# Altium project Lab10.PrjPcb
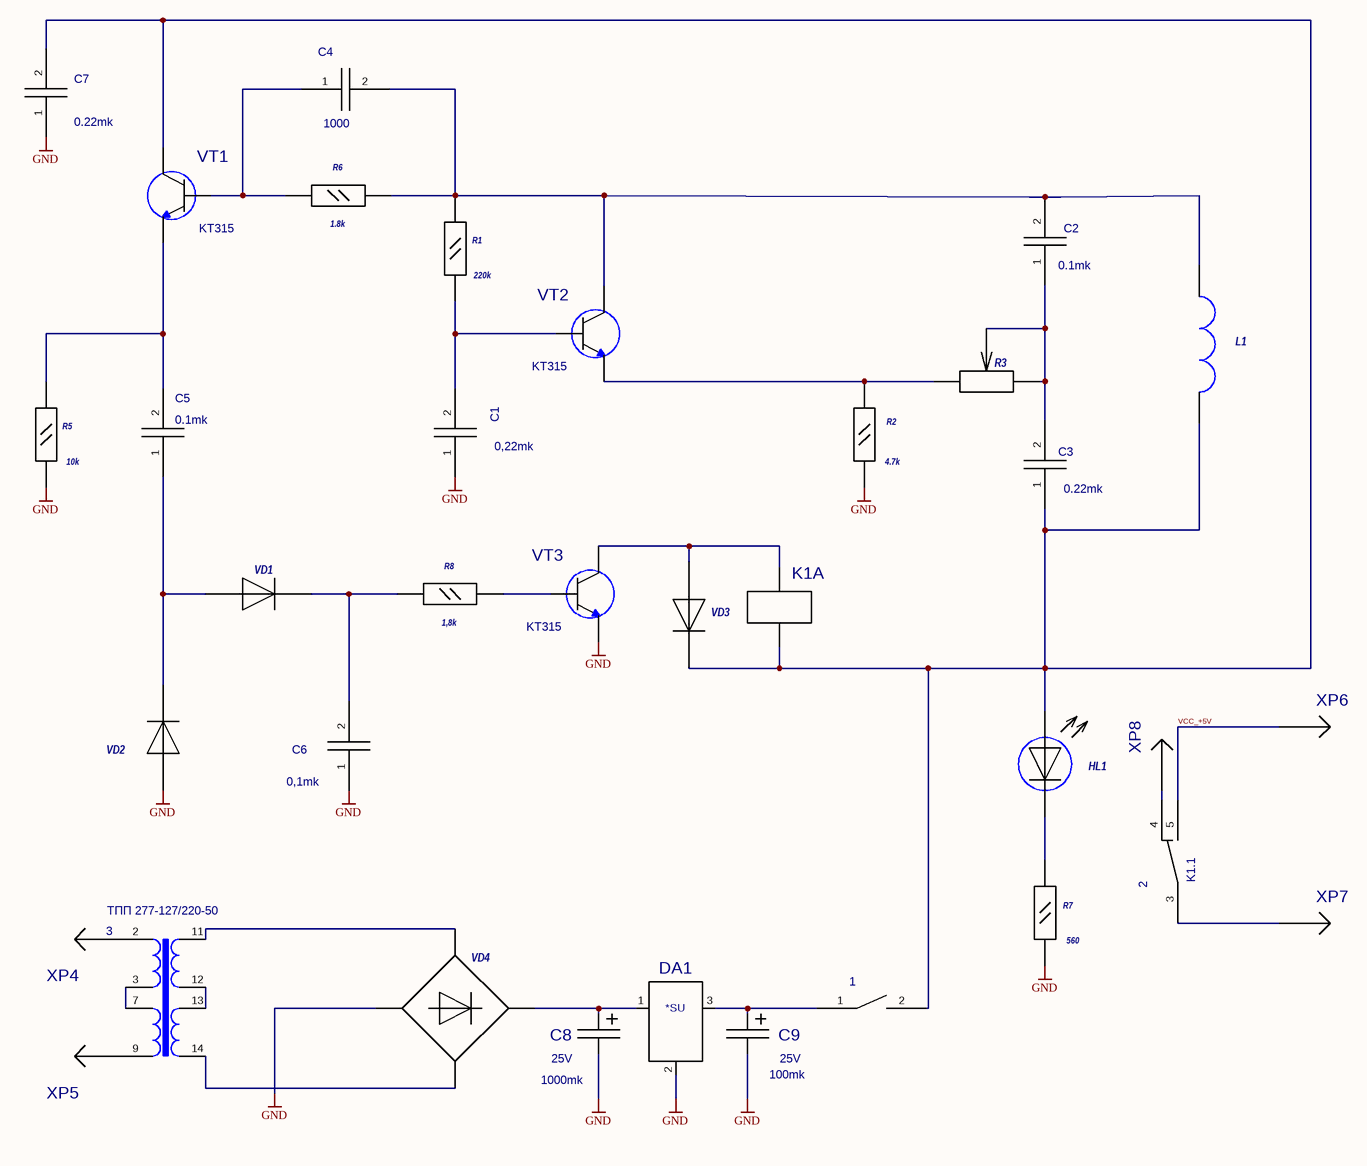
[diagram p0: Sheet1.SCHDOC]
1 sheet, 35 parts. Net scope: global (net labels, ports and power ports of the same name join across sheets).

## Sheet Sheet1.SCHDOC
size 420 x 297 mm; SheetNumber: 1; SheetTotal: 1; DocumentName: Sheet1.SCHDOC

### Parts
1  T1  [T1]  (value not drawn)
2  K1.1  [K1.1]
3  ТПП 277-127/220-50  [ТПП 277-127/220-50]
C1  value 0,22mk  [KM6A - M47]  (hidden comment: 25)
C2  value 0.1mk  [KM6A - M47]  (hidden comment: 25)
C3  value 0.22mk  [KM6A - M47]  (hidden comment: 25)
C4  value 1000  [KM6A - M47]  (hidden comment: 25)
C5  value 0.1mk  [KM6A - M47]  (hidden comment: 25)
C6  value 0,1mk  [KM6A - M47]  (hidden comment: 25)
C7  value 0.22mk  [KM6A - M47]  (hidden comment: 25)
C8  value 25V  [K534A-1]  (hidden comment: K534A-1)
C9  value 25V  [K534A-1]  (hidden comment: K534A-1)
DA1  KR142EN  [KR142EN]  (value not drawn)
HL1  АЛ307  [АЛ307]  (value not drawn)
K1  РЭС-64  [RES64]  (value not drawn)  (part A of 2)
L1  L (3,5)  [L (3,5)]  (value not drawn)
R1  value 220k  [МЛТ(0.125)]  (hidden comment: МЛТ(0.125))
R2  value 4.7k  [МЛТ(0.125)]  (hidden comment: МЛТ(0.125))
R3  СП3-38В  [СП3-38В]  (value not drawn)
R5  value 10k  [МЛТ(0.125)]  (hidden comment: МЛТ(0.125))
R6  value 1.8k  [МЛТ(0.125)]  (hidden comment: МЛТ(0.125))
R7  value 560  [МЛТ(0.125)]  (hidden comment: МЛТ(0.125))
R8  value 1,8k  [МЛТ(0.125)]  (hidden comment: МЛТ(0.125))
VD1  КД522Б  [КД522]  (value not drawn)
VD2  КД522Б  [КД522]  (value not drawn)
VD3  КД522Б  [КД522]  (value not drawn)
VD4  КЦ407  [КЦ407]  (value not drawn)
VT1  KT315  [KT-13]
VT2  KT315  [KT-13]
VT3  KT315  [KT-13]
XP4  XP1  [PAD]  (value not drawn)
XP5  XP1  [PAD]  (value not drawn)
XP6  XP1  [PAD]  (value not drawn)
XP7  XP1  [PAD]  (value not drawn)
XP8  XP1  [PAD]  (value not drawn)

### Nets
GND: C1.1 C6.1 C7.1 C8.2(I/OB) C9.2(I/OB) DA1.2(GND0) R2.1 R5.1 R7.1 VD2.1 VD4.1 VT3.1(E)
VCC_+5V: 2.5 XP6.1(A1)
Net1_1: 1.1 C9.1(I/OA) DA1.3(OUT0)
Net1_2: 1.2 C3.1 C7.2 HL1.1 K1.1(I/O1) L1.2 VD3.2 VT1.2(K)
Net2_3: 2.3 XP7.1(A1)
Net2_4: 2.4 XP8.1(A1)
Net3_2: 3.2 XP4.1(A1)
Net3_3: 3.3 3.7
Net3_9: 3.9 XP5.1(A1)
Net3_11: 3.11 VD4.2
Net3_12: 3.12 3.13
Net3_14: 3.14 VD4.5
NetC1_2: C1.2 R1.1 VT2.3(B)
NetC2_1: C2.1 C3.2 R3.2 R3.3
NetC2_2: C2.2 C4.2 L1.1 R1.2 R6.1 VT2.2(K)
NetC4_1: C4.1 R6.2 VT1.3(B)
NetC5_1: C5.1 VD1.1 VD2.2
NetC5_2: C5.2 R5.2 VT1.1(E)
NetC6_2: C6.2 R8.2 VD1.2
NetC8_1: C8.1(I/OA) DA1.1(IN0) VD4.3
NetHL1_2: HL1.2 R7.2
NetK1_2: K1.2(I/O2) VD3.1 VT3.2(K)
NetR2_2: R2.2 R3.1 VT2.1(E)
NetR8_1: R8.1 VT3.3(B)

Not connected (* = marked no-connect by the designer): K1 5; VD4 4 6

### Notes on the sheet
- 1000mk
- (near C9) 100mk
- (in symbol KR142EN) *SU

### Library data of the parts
C8 C9 = K534A-1: PDIF_TY: 11245
R3 = СП3-38В: Value: 3,7k
1 = T1: Value: *
2 = K1.1: Value: *
3 = ТПП 277-127/220-50: Value: *
DA1 = KR142EN: Value: *
K1 = РЭС-64: Value: *
VT1-VT3 = KT315: Value: *